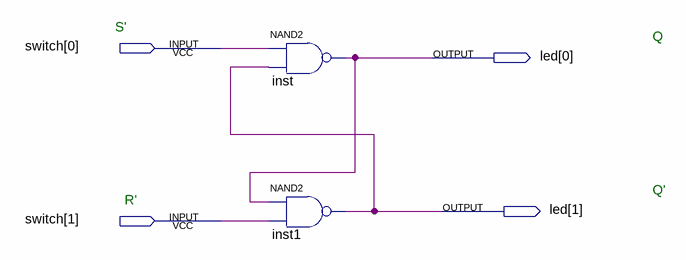
[diagram p0: schematic sheet]
// Quartus schematic pj601.bdf as structural Verilog: 2 symbols, 4 pins
module pj601 (
  input  [1:0] switch,
  output [1:0] led
);

  nand inst (led[0], switch[0], led[1]);
  nand inst1 (led[1], led[0], switch[1]);

  // Notes on the sheet:
  //   S'
  //   Q
  //   Q'
  //   R'
endmodule
